# EAGLE design openSX70-dongle_v3-6 (EAGLE 9.0.0)
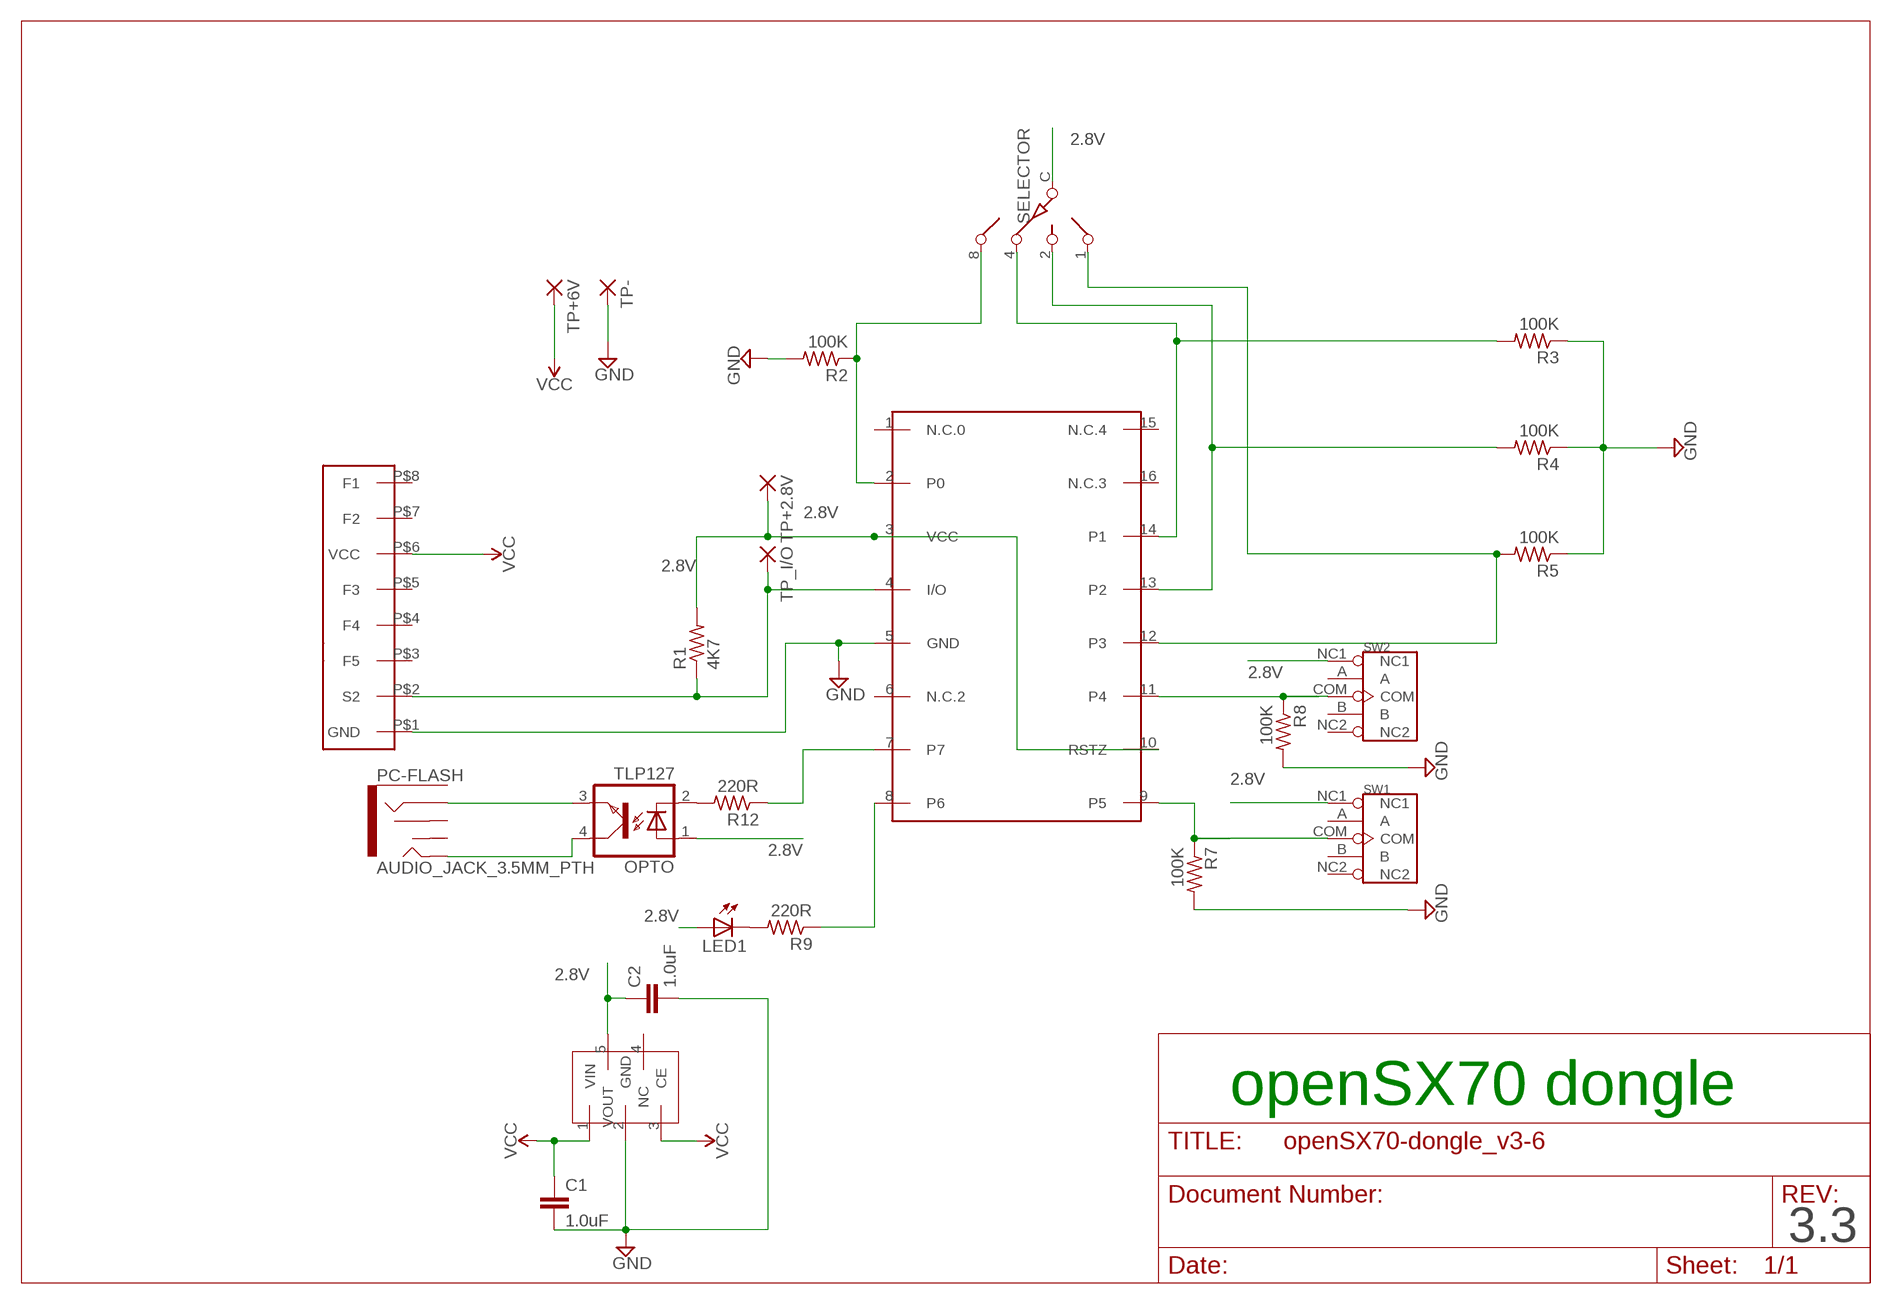
[diagram p0: schematic, sheet 1]

## Parts
C1  1.0uF  C-EUC0603  [C0603]
C2  1.0uF  C-EUC0603  [C0603]
DS2408  DS2408  [SO16]
LED1  LED3MM  [LED3MM]
OPTO  TLP127  [SO-4]
PC-FLASH  AUDIO_JACK_3.5MM_PTH  [AUDIO-JACK]
R1  4K7  R-US_M0805  [M0805]
R2  100K  R-US_M0805  [M0805]
R3  100K  R-US_M0805  [M0805]
R4  100K  R-US_M0805  [M0805]
R5  100K  R-US_M0805  [M0805]
R7  100K  R-US_M0805  [M0805]
R8  100K  R-US_M0805  [M0805]
R9  220R  R-US_M0805  [M0805]
R12  220R  R-US_M0805  [M0805]
REG  NCP4688  [SOT-23-5]
SELECTOR  SW-C16  [SW-C16]
SW1  DIP-TOGGLE-SWITCH-ON-ON(3+2P-8.8X4.6MM)-90D  [SW5-2.0-8.8X4.4X4.7MM-90D]
SW2  DIP-TOGGLE-SWITCH-ON-ON(3+2P-8.8X4.6MM)-90D  [SW5-2.0-8.8X4.4X4.7MM-90D]
TP+2.8V  SMD2  [SMD1,27-2,54]
TP+6V  SMD2  [SMD1,27-2,54]
TP-  SMD2  [SMD1,27-2,54]
TP_I/O  SMD2  [SMD1,27-2,54]
U$1  FLASH-EDGE-CONNECTOR  [FLASH-EDGE-8]

## Nets
2.8V: C2.1 DS2408.3(VCC) DS2408.10(RSTZ) LED1.A OPTO.1(A) R1.2 REG.5(VOUT) SELECTOR.C SW1.NC1 SW2.NC1 TP+2.8V.1(P)
GND: C1.2 C2.2 DS2408.5(GND) R2.2 R3.1 R4.1 R5.1 R7.2 R8.2 REG.2(GND) TP-.1(P) U$1.P$1(GND)
N$1: DS2408.4(I/O) R1.1 TP_I/O.1(P) U$1.P$2(S2)
N$2: LED1.K(C) R9.2
N$3: DS2408.2(P0) R2.1 SELECTOR.8
N$4: DS2408.14(P1) R3.2 SELECTOR.4
N$5: DS2408.13(P2) R4.2 SELECTOR.2
N$6: DS2408.11(P4) R8.1 SW2.COM
N$7: DS2408.9(P5) R7.1 SW1.COM
N$8: DS2408.8(P6) R9.1
N$10: OPTO.2(C) R12.2
N$11: DS2408.7 R12.1
N$12: OPTO.4(COL) PC-FLASH.TIP
N$13: DS2408.12(P3) R5.2 SELECTOR.1
N$15: OPTO.3(EMIT) PC-FLASH.RING
VCC: C1.1 REG.1(VIN) REG.3(CE) TP+6V.1(P) U$1.P$6(VCC)
Unconnected: DS2408.1(N.C.0) DS2408.6(N.C.2) DS2408.15(N.C.4) DS2408.16(N.C.3) PC-FLASH.RSH PC-FLASH.SLEEVE PC-FLASH.TSH REG.4(NC) SW1.A SW1.B SW1.NC2 SW2.A SW2.B SW2.NC2 U$1.P$3(F5) U$1.P$4(F4) U$1.P$5(F3) U$1.P$7(F2) U$1.P$8(F1)

## Notes on the sheet
- openSX70 dongle
- 3.3

## Library data of the parts
C1 C2 = rcl:C-EU: CAPACITOR, European symbol; SPICEPREFIX: C
DS2408 = DS2408-joaco:DS2408
LED1 = adafruit:LED: LED OSRAM: - CHIPLED LG R971, LG N971, LY N971, LG Q971, LY Q971, LO R971, LY R971 LH N974, LH R974 LS Q976, LO Q976, LY Q976 LO Q996 - Hyper CHIPLED LW Q18S LB Q993, LB Q99A, LB R99A - SideLED LS A670, LO A670, LY A670, LG A670, LP A670 LB A673, LV A673, LT A673, LW A673 LH A674 LY A675 LS A676, LA A676, LO A676, LY A676, LW A676 LS A679, LY A679, LG A679 - Hyper Micro SIDELED® LS Y876, LA Y876, LO Y876, LY Y876 LT Y87S - SmartLED LW L88C, LW L88S LB L89C, LB L89S, LG L890 LS L89K, LO L89K, LY L89K LS L896, LA L896, LO L896, LY L896 - TOPLED LS T670, LO T670, LY T670, LG T670, LP T670 LSG T670, LSP T670, LSY T670, LOP T670, LYG T670 LG T671, LOG T671, LSG T671 LB T673, LV T673, LT T673, LW T673 LH T674 LS T676, LA T676, LO T676, LY T676, LB T676, LH T676, LSB T676, LW T676 LB T67C, LV T67C, LT T67C, LS T67K, LO T67K, LY T67K, LW E67C LS E67B, LA E67B, LO E67B, LY E67B, LB E67C, LV E67C, LT E67C LW T67C LS T679, LY T679, LG T679 LS T770, LO T770, LY T770, LG T770, LP T770 LB T773, LV T773, LT T773, LW T773 LH T774 LS E675, LA E675, LY E675, LS T675 LS T776, LA T776, LO T776, LY T776, LB T776 LHGB T686 LT T68C, LB T68C - Hyper Mini TOPLED® LB M676 - Mini TOPLED Santana® LG M470 LS M47K, LO M47K, LY M47K Source: http://www.osram.convergy.de/
OPTO = openSX70:TLP127
PC-FLASH = SparkFun-Connectors:AUDIO_JACK_3.5MM: Audio Jack 3.5mm variants of PTH and SMT stereo audio jack with bypass switches. SparkFun Products: SparkFun SparkPunk Sound Kit <[https://www.sparkfun.com/products/11177]> - PTH MP3 Trigger <https://www.sparkfun.com/products/13720> -3.5mm SMD SparkFun PicoBoard <https://www.sparkfun.com/products/11888>- 2.5mm SMD; PROD_ID: CONN-08774; SF_ID: PRT-08032
R1-R5 R7-R9 R12 = rcl:R-US_: RESISTOR, American symbol; SPICEPREFIX: R
REG = openSX70:NCP4688
SELECTOR = special:SW-C16: SWITCH 16-step rotary switch
SW1 SW2 = Seeed-Switch:DIP-TOGGLE-SWITCH-ON-ON(3+2P-8.8X4.6MM)-90D: 311030008; MPN: 3P-2.0-90D3P-2.0-90D-REINFORCE
TP+2.8V TP+6V TP- TP_I/O = wirepad:SMD2: SMD PAD
U$1 = SX70-flash:FLASH-EDGE-CONNECTOR

## Net classes
0 GND: width 0.305 mm
1 VCC: width 0.254 mm
2 2.8V: width 0.254 mm

## Board
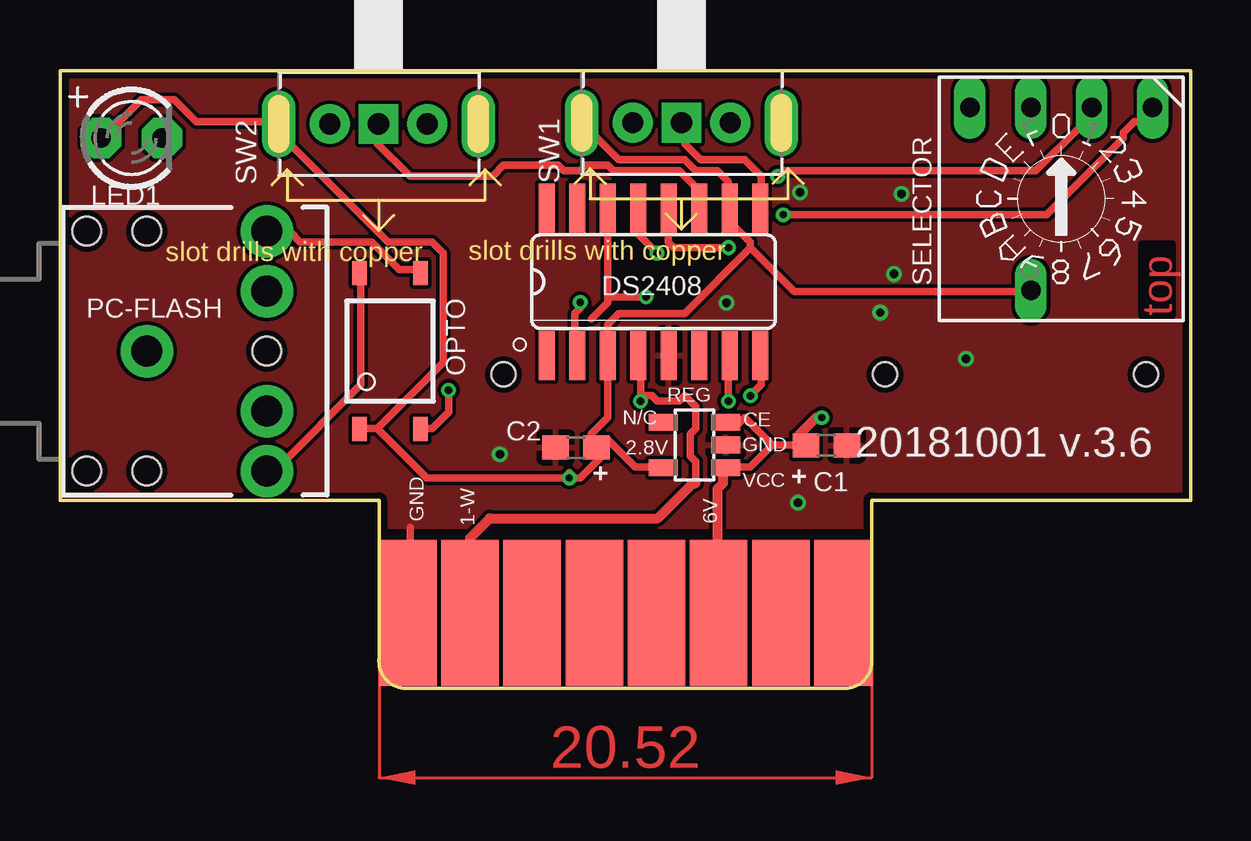
[diagram p1: board, top side]
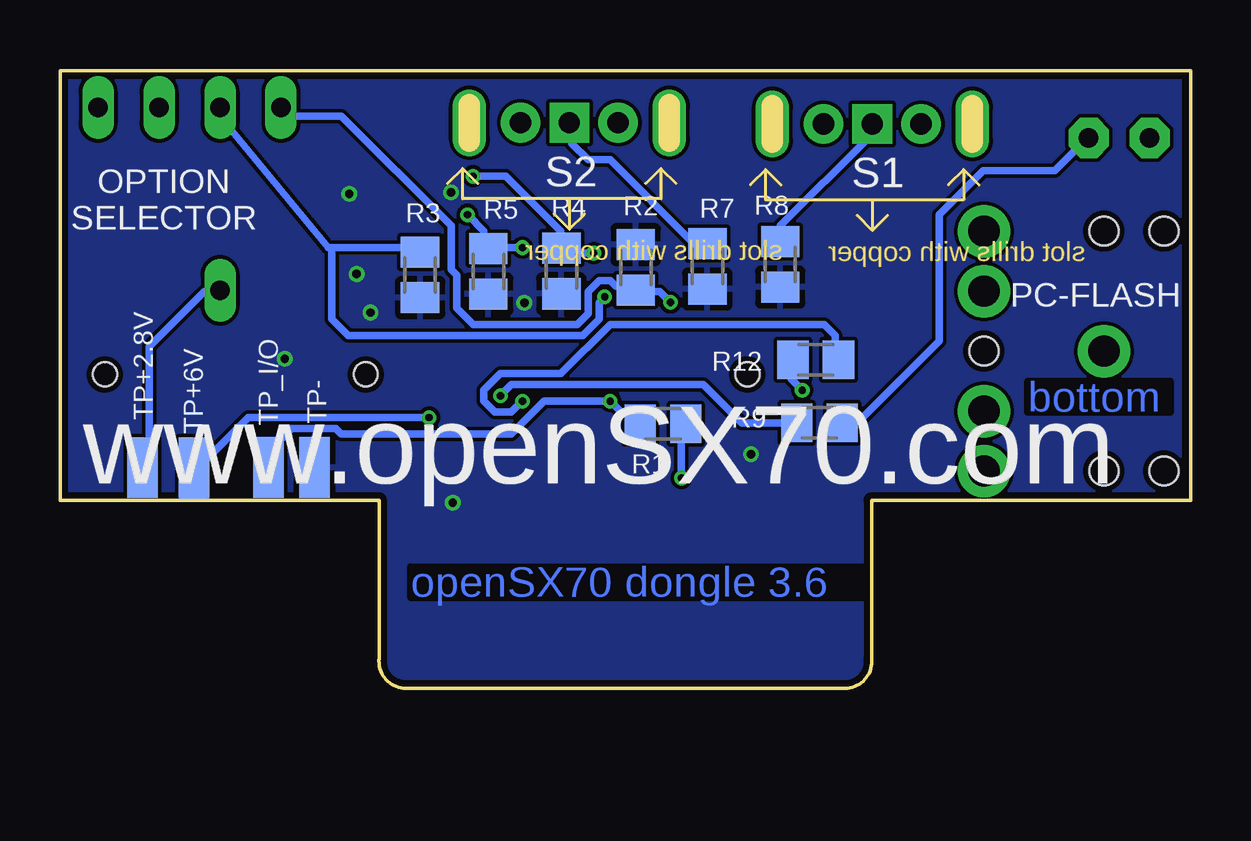
[diagram p2: board, bottom side, seen from below]

Size 47.12 x 25.74 mm. Coordinates in mm from the lower left corner, seen from the top.
Outline: 33.84,7.71 33.82,7.83
Outline: 33.82,7.83 33.82,1.24 arc-90 32.8,0 14.31,0 arc-90 13.3,1.24 13.3,7.83 0,7.83 0,25.74 47.12,25.74 47.12,7.83 33.82,7.83
Copper layers (1*16): Top 0.035mm / dielectric 1.5mm / Bottom 0.035mm
Design rules "SeeedStudio_2layer_DRU_no_angle_20140221": minimum track width 6mil, minimum drill 12mil, track to track 6mil, track to pad 6mil, pad to pad 6mil, via to via 6mil, smd to smd 0mil, copper to edge 10mil, drill to drill 10mil, minimum pad ring 10mil, minimum via ring 6mil, stop-mask expansion 2mil, vias tented up to drill 100mil, thermal gap 10mil
Holes 1 mm at 18.48,13.09 34.38,13.09 45.25,13.09

### Footprints (pad centres in the part's own frame; a part is rotated, then mirrored left to right if it is on the bottom)
C0603 = smd 1.1 x 1: 1 -0.85,0; 2 0.85,0
SO16 = smd 0.66 x 2.032: 1 -4.445,-3.073; 2 -3.175,-3.073; 3 -1.905,-3.073; 4 -0.635,-3.073; 5 0.635,-3.073; 6 1.905,-3.073; 7 3.175,-3.073; 8 4.445,-3.073; 9 4.445,3.073; 10 3.175,3.073; 11 1.905,3.073; 12 0.635,3.073; 13 -0.635,3.073; 14 -1.905,3.073; 15 -3.175,3.073; 16 -4.445,3.073
LED3MM = drill 0.813 pad 1.676 octagon: A -1.27,0; K 1.27,0
SO-4 = smd 1 x 0.6: 1 -3.24,0.635; 2 -3.24,-1.905; 3 3.24,-1.905; 4 3.24,0.635
AUDIO-JACK = drill 1.3 pad 2.184: RING 5,5; RSH 5,2.5; SLEEVE 0,0; TIP 5,-5; TSH 5,-2.5 | hole 1.2: 0,5; -2.5,5; -2.5,-5; 0,-5; 5,0
M0805 = smd 1.3 x 1.6: 1 -0.95,0; 2 0.95,0
SOT-23-5 = smd 0.69 x 1.2: 1 -0.95,-1.3; 2 0,-1.3; 3 0.95,-1.3; 4 0.95,1.3; 5 -0.95,1.3
SW-C16 = drill 0.813 long: 1 -3.81,-3.81; 2 -1.27,-3.81; 4 1.27,-3.81; 8 3.81,-3.81; C 1.27,3.81
SW5-2.0-8.8X4.4X4.7MM-90D = drill 0.889 pad 1.651: A 0,2.032; B 0,-2.032 | drill 0.889 pad 1.651 square: COM 0,0 | drill 0.762 pad 1.397 long: NC1 0,4.166; NC2 0,-4.166
SMD1,27-2,54 = smd 1.27 x 2.54: 1 0,0
FLASH-EDGE-8 = smd 2.4 x 6.09: P$1 -9.065,0; P$2 -6.475,0; P$3 -3.885,0; P$4 -1.295,0; P$5 1.295,0; P$6 3.885,0; P$7 6.475,0; P$8 9.065,0

### Placement (x,y rotation side)
C1  31.94,10.13 0 top
C2  21.5,10.04 180 top
DS2408  24.73,16.95 0 top
LED1  2.98,22.95 0 top
OPTO  13.12,14.06 90 top
PC-FLASH  3.62,14.06 0 top
R1  21.99,11.03 0 bottom
R2  23.13,17.55 90 bottom
R3  32.11,17.24 90 bottom
R4  26.23,17.4 90 bottom
R5  29.27,17.38 90 bottom
R7  20.14,17.59 270 bottom
R8  17.11,17.68 270 bottom
R9  15.47,11.07 0 bottom
R12  15.63,13.7 180 bottom
REG  26.44,10.14 90 top
SELECTOR  41.72,20.41 180 top
SW1  25.9,23.58 90 top
SW2  13.27,23.53 90 top
TP+2.8V  43.68,9.2 180 bottom
TP+6V  41.53,9.19 180 bottom
TP-  36.52,9.2 0 bottom
TP_I/O  38.43,9.21 0 bottom
U$1  23.56,3.15 0 top

### Tracks (layer width: path | path; a pad name or v marks a point on that pad's centre or on a via)
2.8V  (via drill 0.3)
  Top 0.305: LED1.A 1.79,22.95 3.39,24.55 4.76,24.55 5.68,23.63 9.11,23.63 SW2.NC1 9.11,23.4 9.56,22.95 9.56,22.72 13.68,18.6 15.51,18.6 15.96,18.14 15.96,13.57 13.22,10.83 | SW1.NC1 23.28,22.03 26.02,22.03 26.48,21.57 27.39,21.57 27.85,21.12 27.85,20.2 DS2408.10 28.08,19.97 28.08,19.29 28.77,18.6 28.77,18.37 | 13.22,10.83 12.53,10.83 OPTO.1 | 13.22,10.83 15.28,8.77 v21.22,8.77 | v21.22,8.77 21.68,8.77 22.59,9.69 22.59,9.92 22.36,10.14 | 22.36,10.14 22.59,10.37 22.82,10.37 23.96,9.23 25.11,9.23 REG.5 | 22.36,10.14 C2.1 22.14,10.14 22.14,10.6 22.82,11.29 22.82,13.8 DS2408.3 22.82,14.03 22.82,15.17 23.28,15.63 26.02,15.63 28.77,18.37 | v21.22,8.77 21.22,9 | 28.77,18.37 30.59,16.54 40.42,16.54 SELECTOR.C
  Bottom 0.305: v21.22,8.77 21.22,10.83 R1.2 | SELECTOR.C 40.65,16.54 41.11,16.54 43.4,14.26 43.4,9.46 43.62,9.23 TP+2.8V.1
GND  (via drill 0.35)
  Top 0.305: 14.59,6.71 14.59,3.29 U$1.P$1
  other vias: 18.33,9.76 34.76,17.27 34.18,15.67 27.77,16.07 37.75,13.74 35.06,20.62 30.83,20.68 30.75,7.74
  pour Top: 0.44,25.49 47.43,25.49 47.43,6.71 0.44,6.71
  pour Bottom: 0.44,25.49 0.44,7.71 13.14,7.71 13.14,0.36 33.46,0.36 33.46,7.71 47.43,7.71 47.43,25.49
N$1  (via drill 0.3)
  Top 0.305: 24.19,12.2 24.19,13.8 DS2408.4 | 26.48,8.54 26.48,9.46 26.25,9.69 26.25,10.6 26.48,10.83 26.48,11.74 26.02,12.2 25.79,11.97 24.88,11.97 24.65,12.2 24.19,12.2 | 18.11,4.29 U$1.P$2 | 24.19,12.2 v24.19,11.97
  Top 0.406: U$1.P$2 17.08,6.26 17.9,7.09 24.9,7.09 26.36,8.54 26.48,8.54
  Bottom 0.305: R1.1 23.05,11.06 23.51,11.52 23.74,11.52 v24.19,11.97 26.94,11.97 28.31,10.6 35.39,10.6 35.62,10.83 37.45,10.83 38.37,9.92 38.37,9.23 TP_I/O.1
N$2
  Bottom 0.305: R9.2 14.36,11.29 13.68,11.29 10.48,14.49 10.48,19.75 8.65,21.57 5.68,21.57 4.31,22.95 LED1.K
N$3  (via drill 0.3)
  Top 0.305: v21.68,16.09 21.68,15.86 21.45,15.63 21.45,14.03 DS2408.2
  Bottom 0.305: v21.68,16.09 22.14,16.54 23.05,16.54 R2.1 23.28,16.77 23.96,16.77 24.19,17 24.65,17 25.11,16.54 25.11,15.63 25.57,15.17 29.91,15.17 30.59,15.86 30.59,17.23 30.82,17.46 30.82,19.29 35.39,23.86 37.68,23.86 37.91,24.09 SELECTOR.8
N$4  (via drill 0.3)
  Top 0.305: 22.82,16.32 22.82,16.09 22.14,15.4 | 22.82,16.32 22.82,19.97 DS2408.14 | v24.42,16.32 22.82,16.32
  Bottom 0.305: 35.79,18.37 35.94,18.37 40.65,24.09 SELECTOR.4 | 35.79,18.37 32.19,18.37 R3.2 | v24.42,16.32 24.65,16.09 24.65,15.4 25.34,14.72 35.11,14.72 35.79,15.4 35.79,18.37
N$5  (via drill 0.3)
  Top 0.305: v24.88,18.14 23.96,19.06 23.96,19.97 DS2408.13 | SELECTOR.2 42.94,24.09 42.48,23.63 42.48,23.4 40.65,21.57 30.14,21.57 v29.91,21.35
  Bottom 0.305: v24.88,18.14 26.02,18.14 R4.2 26.25,18.37 26.25,19.06 28.54,21.35 v29.91,21.35
N$6
  Top 0.305: DS2408.11 26.48,20.2 26.48,20.89 25.79,21.57 23.05,21.57 22.82,21.8 21.91,21.8 21.68,21.57 20.99,21.57 20.76,21.8 18.48,21.8 18.02,21.35 14.59,21.35 13.22,22.72 13.22,23.4 SW2.COM
  Bottom 0.305: R8.1 17.11,19.29 13.45,22.95 13.45,23.4 SW2.COM
N$7
  Top 0.305: DS2408.9 29.22,20.2 29.22,21.35 28.54,22.03 26.71,22.03 26.02,22.72 26.02,23.4 SW1.COM
  Bottom 0.305: R7.1 20.31,18.6 20.76,18.6 24.19,22.03 25.11,22.03 25.79,22.72 25.79,23.4 SW1.COM
N$8  (via drill 0.3)
  Top 0.305: v28.77,12.2 29.22,12.66 29.22,13.8 DS2408.8
  Bottom 0.305: v28.77,12.2 28.31,12.66 20.31,12.66 18.71,11.06 16.65,11.06 R9.1
N$10  (via drill 0.3)
  Top 0.305: v16.19,12.43 16.19,11.52 15.51,10.83 15.05,10.83 OPTO.2
  Bottom 0.305: v16.19,12.43 16.65,12.89 16.65,13.57 R12.2
N$11  (via drill 0.3)
  Top 0.305: v27.85,11.97 27.85,13.8 DS2408.7
  Bottom 0.305: v27.85,11.97 28.31,11.52 28.99,11.52 29.45,11.97 29.45,12.43 28.77,13.12 26.25,13.12 24.19,15.17 15.28,15.17 14.82,14.72 14.82,13.8 R12.1
N$12
  Top 0.305: OPTO.4 12.53,17.23 12.53,12.66 9.11,9.23 8.65,9.23 PC-FLASH.TIP
N$13  (via drill 0.3)
  Top 0.305: v27.85,18.37 25.57,18.37 25.34,18.6 25.34,19.97 DS2408.12 | v30.14,19.75 41.11,19.75 44.31,22.95 44.31,23.17 44.77,23.63 45,23.63 45.45,24.09 SELECTOR.1
  Bottom 0.305: v27.85,18.37 29.22,18.37 R5.2 29.45,18.37 29.45,19.06 v30.14,19.75
N$15
  Top 0.305: OPTO.3 14.82,17.46 14.14,17.46 12.99,18.6 10.02,18.6 9.56,19.06 8.65,19.06 PC-FLASH.RING
VCC  (via drill 0.3)
  Top 0.305: 29.68,10.14 30.82,10.14 | 30.82,10.14 31.05,10.14 C1.1 30.82,10.14 | 29.68,10.14 28.54,11.29 28.31,11.06 27.85,11.06 REG.3 | 29.68,10.14 28.77,9.23 27.85,9.23 REG.1 27.62,9 | 30.82,10.14 30.82,10.6 | 27.39,3.29 U$1.P$6 | 31.51,11.29 v31.74,11.29
  Top 0.406: 30.82,10.6 31.51,11.29 | 27.39,3.29 27.39,8.32 27.62,8.54 27.62,9
  Bottom 0.305: v31.74,11.29 39.28,11.29 41.34,9.23 TP+6V.1
(copper drawn outside any net)
  shapes: Top area x1

### Text on the board
Top: top
Bottom: bottom | openSX70 dongle 3.6
tPlace: 20181001 v.3.6 | + | +
bPlace: www.openSX70.com
tNames: N/C | CE | 2.8V | GND | VCC | GND | 1-W | 6V
bNames: S1 | S2 | OPTION / SELECTOR | PC-FLASH